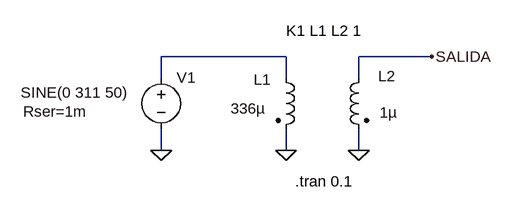
[diagram p0: schematic Transformador.asc]
Transformador.asc, the LTspice schematic file:
Version 4
SHEET 1 880 680
WIRE 192 112 0 112
WIRE 416 112 304 112
WIRE 0 144 0 112
WIRE 192 144 192 112
WIRE 304 144 304 112
WIRE 0 256 0 224
WIRE 192 256 192 224
WIRE 304 256 304 224
FLAG 192 256 0
FLAG 304 256 0
FLAG 0 256 0
FLAG 416 112 SALIDA
SYMBOL ind2 176 128 R0
WINDOW 0 -34 19 Left 2
WINDOW 3 -69 64 Left 2
SYMATTR InstName L1
SYMATTR Value 336µ
SYMATTR Type ind
SYMBOL ind2 320 128 M0
WINDOW 0 -41 14 Left 2
WINDOW 3 -43 70 Left 2
SYMATTR InstName L2
SYMATTR Value 1µ
SYMATTR Type ind
SYMBOL voltage 0 128 R0
WINDOW 3 -216 39 Left 2
WINDOW 123 0 0 Left 0
WINDOW 39 -212 68 Left 2
SYMATTR InstName V1
SYMATTR Value SINE(0 311 50)
SYMATTR SpiceLine Rser=1m
TEXT 192 72 Left 2 !K1 L1 L2 1
TEXT 206 304 Left 2 !.tran 0.1

The netlist it stands for:
* Transformador.asc
L1 N001 0 336µ
L2 SALIDA 0 1µ
V1 N001 0 SINE(0 311 50) Rser=1m
K1 L1 L2 1
.tran 0.1
.backanno
.end